# Altium project E3TP2E6.PrjPcb
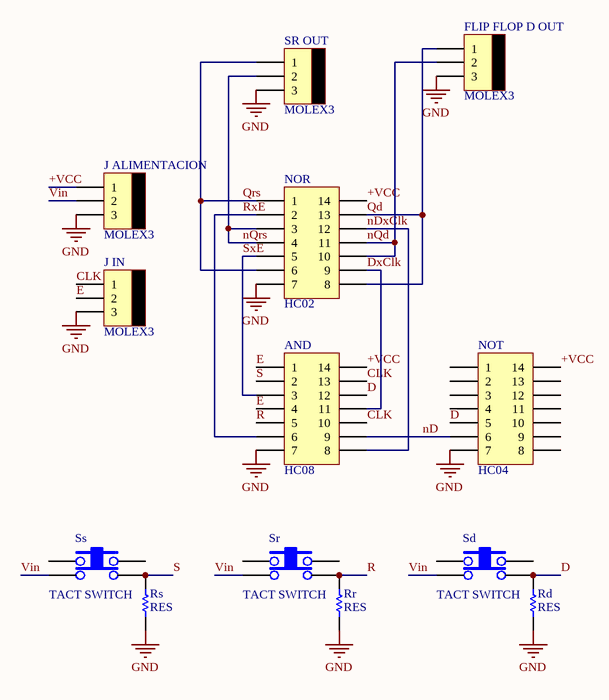
[diagram p0: LatchSR.SchDoc]
1 sheet, 13 parts. Net scope: global (net labels, ports and power ports of the same name join across sheets).
Board file: LatchSR-D.PcbDoc

## Sheet LatchSR.SchDoc
size A

### Parts
AND  HC08  [DIP14]
FLIP_FLOP_D_OUT  MOLEX3  [MOLEX3]
J_ALIMENTACION  MOLEX3  [MOLEX3]
J_IN  MOLEX3  [MOLEX3]
NOR  HC02  [DIP14]
NOT  HC04  [DIP14]
Rd  RES  [RES400]
Rr  RES  [RES400]
Rs  RES  [RES400]
Sd  TACT SWITCH  [TACTSWITCH]
Sr  TACT SWITCH  [TACTSWITCH]
SR_OUT  MOLEX3  [MOLEX3]
Ss  TACT SWITCH  [TACTSWITCH]

### Nets
GND: AND.7 FLIP_FLOP_D_OUT.3 J_ALIMENTACION.3 J_IN.3 NOR.7 NOT.7 Rd.1 Rr.1 Rs.1 SR_OUT.3
+VCC: AND.14 J_ALIMENTACION.1 NOR.14 NOT.14
CLK: AND.10 AND.13 J_IN.1
D: AND.12 NOT.5 Rd.2 Sd.4
DxClk: AND.11 NOR.9
E: AND.1 AND.4 J_IN.2
nD: AND.9 NOT.6
nDxClk: AND.8 NOR.12
nQd: FLIP_FLOP_D_OUT.2 NOR.10 NOR.11
nQrs: NOR.3 NOR.4 SR_OUT.2
Qd: FLIP_FLOP_D_OUT.1 NOR.8 NOR.13
Qrs: NOR.1 NOR.6 SR_OUT.1
R: AND.5 Rr.2 Sr.4
RxE: AND.6 NOR.2
S: AND.2 Rs.2 Ss.4
SxE: AND.3 NOR.5
Vin: J_ALIMENTACION.2 Sd.2 Sr.2 Ss.2

Not connected (* = marked no-connect by the designer): NOT 1 2 3 4 8 9 10 11 12 13; Sd 1 3; Sr 1 3; Ss 1 3

### Library data of the parts
AND NOR NOT = IC_DIP14